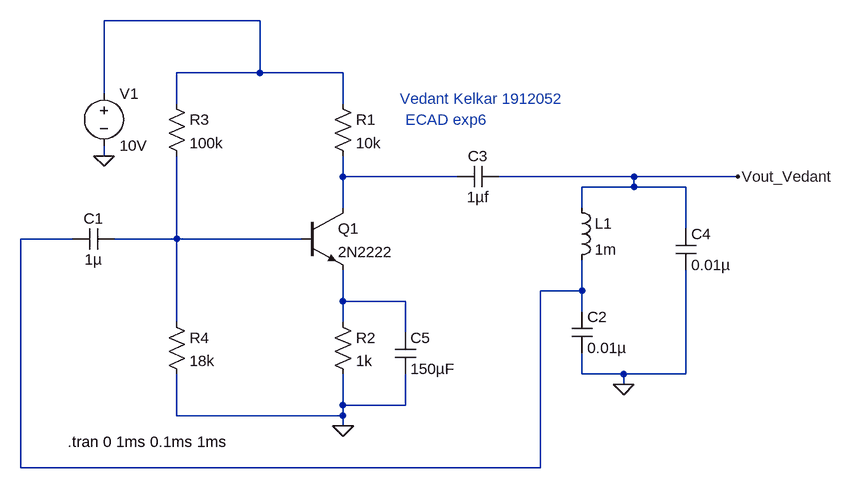
[diagram p0: schematic ECAD_exp31.asc]
ECAD_exp31.asc, the LTspice schematic file:
Version 4
SHEET 1 984 680
WIRE 80 -160 -160 -160
WIRE 80 -80 80 -160
WIRE 80 -80 -48 -80
WIRE 208 -80 80 -80
WIRE -160 -48 -160 -160
WIRE -48 -32 -48 -80
WIRE 208 -32 208 -80
WIRE -160 48 -160 32
WIRE 208 80 208 48
WIRE 384 80 208 80
WIRE 656 80 448 80
WIRE 816 80 656 80
WIRE 656 96 656 80
WIRE 656 96 576 96
WIRE 736 96 656 96
WIRE 208 128 208 80
WIRE 576 128 576 96
WIRE 736 160 736 96
WIRE -208 176 -288 176
WIRE -48 176 -48 48
WIRE -48 176 -144 176
WIRE 144 176 -48 176
WIRE 576 256 576 208
WIRE 576 256 512 256
WIRE 208 272 208 224
WIRE 304 272 208 272
WIRE 576 288 576 256
WIRE -48 304 -48 176
WIRE 208 304 208 272
WIRE 304 320 304 272
WIRE 576 384 576 352
WIRE 640 384 576 384
WIRE 736 384 736 224
WIRE 736 384 640 384
WIRE 640 400 640 384
WIRE 208 432 208 384
WIRE 304 432 304 384
WIRE 304 432 208 432
WIRE -48 448 -48 384
WIRE 208 448 208 432
WIRE 208 448 -48 448
WIRE 208 464 208 448
WIRE -288 528 -288 176
WIRE 512 528 512 256
WIRE 512 528 -288 528
FLAG 816 80 Vout_Vedant
FLAG -160 48 0
FLAG 208 464 0
FLAG 640 400 0
SYMBOL npn 144 128 R0
SYMATTR InstName Q1
SYMATTR Value 2N2222
SYMBOL res 192 -48 R0
SYMATTR InstName R1
SYMATTR Value 10k
SYMBOL res 192 288 R0
SYMATTR InstName R2
SYMATTR Value 1k
SYMBOL res -64 -48 R0
SYMATTR InstName R3
SYMATTR Value 100k
SYMBOL res -64 288 R0
SYMATTR InstName R4
SYMATTR Value 18k
SYMBOL cap -208 160 M90
WINDOW 0 0 32 VBottom 2
WINDOW 3 32 32 VTop 2
SYMATTR InstName C1
SYMATTR Value 1µ
SYMBOL cap 560 288 R0
SYMATTR InstName C2
SYMATTR Value 0.01µ
SYMBOL ind 560 112 R0
SYMATTR InstName L1
SYMATTR Value 1m
SYMBOL cap 448 64 R90
WINDOW 0 0 32 VBottom 2
WINDOW 3 32 32 VTop 2
SYMATTR InstName C3
SYMATTR Value 1µf
SYMBOL cap 720 160 R0
SYMATTR InstName C4
SYMATTR Value 0.01µ
SYMBOL voltage -160 -64 R0
WINDOW 123 0 0 Left 0
WINDOW 39 0 0 Left 0
SYMATTR InstName V1
SYMATTR Value 10V
SYMBOL cap 288 320 R0
SYMATTR InstName C5
SYMATTR Value 150µF
TEXT -216 488 Left 2 !.tran 0 1ms 0.1ms 1ms
TEXT 296 -40 Left 2 ;Vedant Kelkar 1912052
TEXT 304 -8 Left 2 ;ECAD exp6

The netlist it stands for:
* ECAD_exp31.asc
Q1 N002 N004 N005 0 2N2222
R1 N001 N002 10k
R2 N005 0 1k
R3 N001 N004 100k
R4 N004 0 18k
C1 N003 N004 1µ
C2 N003 0 0.01µ
L1 Vout_Vedant N003 1m
C3 Vout_Vedant N002 1µf
C4 Vout_Vedant 0 0.01µ
V1 N001 0 10V
C5 N005 0 150µF
.model NPN NPN
.model PNP PNP
.lib standard.bjt
.tran 0 1ms 0.1ms 1ms
* Vedant Kelkar 1912052
* ECAD exp6
.backanno
.end